# Altium schematic sheet [4] Wifi_ESP32_Antenna.SchDoc
size A4; Organization: UNMEI ELECTRICAL; Address1: 16B/12 Nguyen Du Street; Address2: Da Lat City, LD Province; SheetNumber: 4; SheetTotal: 7
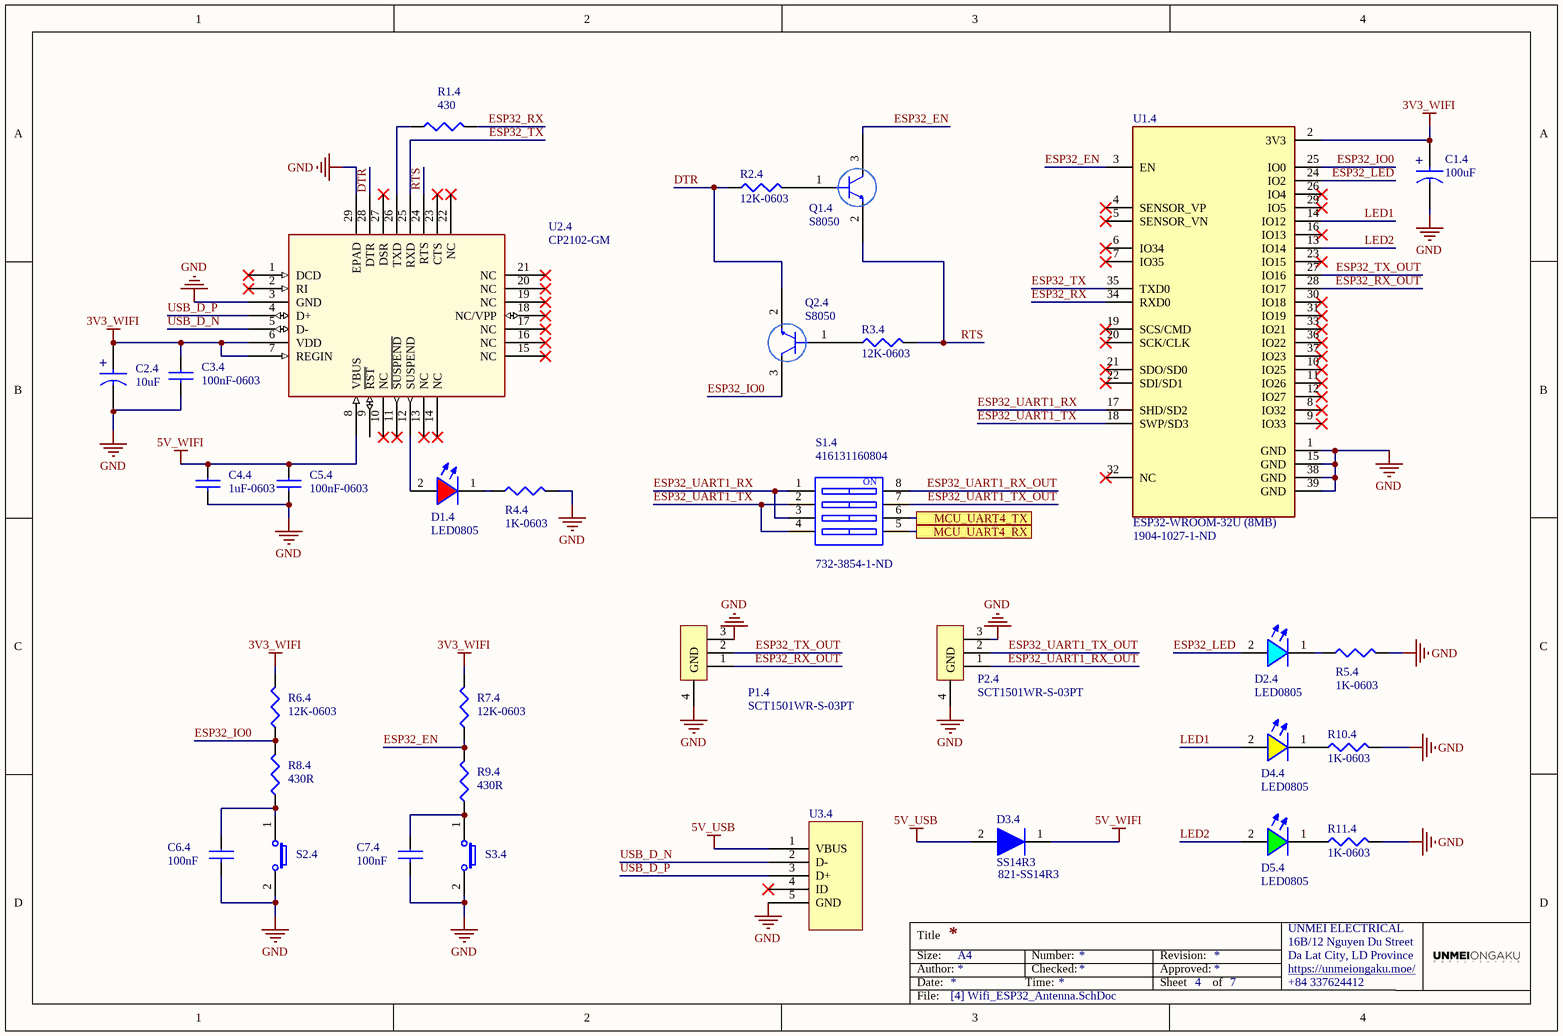
[diagram p0: [4] Wifi_ESP32_Antenna.SchDoc]

## Parts
C1.4  100uF  [Capacitor/Tantalum  - SMD6032/C - AVX]
C2.4  10uF  [Capacitor/Tantalum  - SMD3528/B - AVX]
C3.4  100nF-0603  [CAP0603]
C4.4  1uF-0603  [CAP0603]
C5.4  100nF-0603  [CAP0603]
C6.4  100nF  [CAP0603]
C7.4  100nF  [CAP0603]
D1.4  LED0805  [LED0805-RED]
D2.4  LED0805  [LED0805-BLUE]
D3.4  SS14R3  Supplier Part Number 1: 821-SS14R3  [SS14 - 1N5819 / DO-214AA, SMA]
D4.4  LED0805  [LED0805-YELLOW]
D5.4  LED0805  [LED0805-GREEN]
P1.4  SCT1501WR-S-03PT  [Connector ZH1.5 3P SMD]
P2.4  SCT1501WR-S-03PT  [Connector ZH1.5 3P SMD]
Q1.4  S8050  [SOT23]
Q2.4  S8050  [SOT23]
R1.4  430  [RES0603 - 3D]
R2.4  12K-0603  [RES0603 - 3D]
R3.4  12K-0603  [RES0603 - 3D]
R4.4  1K-0603  [RES0603 - 3D]
R5.4  1K-0603  [RES0603 - 3D]
R6.4  12K-0603  [RES0603 - 3D]
R7.4  12K-0603  [RES0603 - 3D]
R8.4  430R  [RES0603 - 3D]
R9.4  430R  [RES0603 - 3D]
R10.4  1K-0603  [RES0603 - 3D]
R11.4  1K-0603  [RES0603 - 3D]
S1.4  416131160804  Supplier Part Number 1: 732-3854-1-ND  [DIP Switches SMD 1.27mm 4P]
S2.4  434121043816  [Switches-6x3.5x4.3mm]  (value not drawn)
S3.4  434121043816  [Switches-6x3.5x4.3mm]  (value not drawn)
U1.4  ESP32-WROOM-32U (8MB)  Supplier Part Number 1: 1904-1027-1-ND  [ESP32 WROOM 32U]
U2.4  CP2102-GM  [QFN28_5X5_SIL]
U3.4  Micro USB - UJ2-MIBH-G-SMT-TR  [Micro USB V2 SMD]  (value not drawn)

## Ports
MCU_UART4_RX, MCU_UART4_TX

## Nets
3V3_WIFI: C1.4.1 C2.4.1 C3.4.1 R6.4.2 R7.4.2 U1.4.2(3V3) U2.4.6(VDD) U2.4.7(REGIN)
5V_USB: D3.4.2 U3.4.1(VBUS)
5V_WIFI: C4.4.1 C5.4.1 D3.4.1 U2.4.8(VBUS)
GND: C1.4.2 C2.4.2 C3.4.2 C4.4.2 C5.4.2 C6.4.2 C7.4.2 P1.4.3 P1.4.4(GND) P2.4.3 P2.4.4(GND) R4.4.2 R5.4.2 R10.4.2 R11.4.2 S2.4.2 S3.4.2 U1.4.1(GND) U1.4.15(GND) U1.4.38(GND) U1.4.39(GND) U2.4.3(GND) U2.4.29(EPAD) U3.4.5(GND)
DTR: Q2.4.2 R2.4.1 U2.4.28(DTR)
ESP32_EN: Q1.4.3 R7.4.1 R9.4.2 U1.4.3(EN)
ESP32_IO0: Q2.4.3 R6.4.1 R8.4.2 U1.4.25(IO0)
ESP32_LED: D2.4.2(+) U1.4.24(IO2)
ESP32_RX: R1.4.2 U1.4.34(RXD0)
ESP32_RX_OUT: P1.4.1 U1.4.28(IO17)
ESP32_TX: U1.4.35(TXD0) U2.4.25(RXD)
ESP32_TX_OUT: P1.4.2 U1.4.27(IO16)
ESP32_UART1_RX: S1.4.1 S1.4.3 U1.4.17(SHD/SD2)
ESP32_UART1_RX_OUT: P2.4.1 S1.4.8
ESP32_UART1_TX: S1.4.2 S1.4.4 U1.4.18(SWP/SD3)
ESP32_UART1_TX_OUT: P2.4.2 S1.4.7
LED1: D4.4.2(+) U1.4.14(IO12)
LED2: D5.4.2(+) U1.4.13(IO14)
MCU_UART4_RX: S1.4.5 ; port MCU_UART4_RX
MCU_UART4_TX: S1.4.6 ; port MCU_UART4_TX
RTS: Q1.4.2 R3.4.2 U2.4.24(RTS)
USB_D_N: U2.4.5(D-) U3.4.2(D-)
USB_D_P: U2.4.4(D+) U3.4.3(D+)
NetC6.4_1: C6.4.1 R8.4.1 S2.4.1
NetC7.4_1: C7.4.1 R9.4.1 S3.4.1
NetD1.4_1: D1.4.1(+) R4.4.1
NetD1.4_2: D1.4.2(+) U2.4.12(SUSPEND)
NetD2.4_1: D2.4.1(+) R5.4.1
NetD4.4_1: D4.4.1(+) R10.4.1
NetD5.4_1: D5.4.1(+) R11.4.1
NetQ1.4_1: Q1.4.1 R2.4.2
NetQ2.4_1: Q2.4.1 R3.4.1
NetR1.4_1: R1.4.1 U2.4.26(TXD)

Not connected (* = marked no-connect by the designer): U1.4 4(SENSOR_VP)* 5(SENSOR_VN)* 6(IO34)* 7(IO35)* 8(IO32)* 9(IO33)* 10(IO25)* 11(IO26)* 12(IO27)* 16(IO13)* 19(SCS/CMD)* 20(SCK/CLK)* 21(SDO/SD0)* 22(SDI/SD1)* 23(IO15)* 26(IO4)* 29(IO5)* 30(IO18)* 31(IO19)* 32(NC)* 33(IO21)* 36(IO22)* 37(IO23)*; U2.4 1(DCD)* 2(RI)* 9(~{RST}) 10(NC)* 11(~{SUSPEND})* 13(NC)* 14(NC)* 15(NC)* 16(NC)* 17(NC)* 18(NC/VPP)* 19(NC)* 20(NC)* 21(NC)* 22(NC)* 23(CTS)* 27(DSR)*; U3.4 4(ID)*

## Notes on the sheet
- Title
- Size:
- Date:
- Author:
- A4
- Time:
- Number:
- Checked:
- Revision:
- Sheet
- Approved:
- of
- https://unmeiongaku.moe/
- +84 337624412
- File:
- (in symbol 416131160804) ON
- (in symbol TAJB106K016RNJ) +
- (in symbol TAJC107K006RNJ) +

## Library data of the parts
C1.4 = TAJC107K006RNJ: 钽电容 100uF ±10% 6.3V 0.9Ω C型6032; Manufacturer: Kyocera AVX; Dielectric Material: Tantalum; ESR (Equivalent Series Resistance): 900mR; Leakage Current: 6.3uA; Polarity: Polar; Dissipation Factor: 6%; Supplier 1: RSComponents; Manufacturer Part Number: TAJC107K006RNJ; RoHS: Yes; Category: Tantalum Capacitors; Stock 1: 1; Pricing 1: 20=0.52900, 100=0.36400, 400=0.34700, 1000=0.21400 (USD); Mount: Surface Mount; Case/Package: Molded; Case Code (Metric): 6032; Case Code (Imperial): 2312; Min Operating Temperature: -55°C; Max Operating Temperature: 125°C; Capacitance: 100uF; Tolerance: 10%; Packaging: Tape and Reel; Voltage Rating: 6.3V; Package Quantity: 1; Termination: SMD/SMT; Features: General Purpose; Series: TAJ; Construction: Flat; Length: 6mm; Width: 3.2mm; Height: 2.6mm; Depth: 3.2mm; Height - Seated (Max): 0.11inch; Radiation Hardening: No; REACH SVHC: No SVHC; Lead Free: Lead Free; RoHS Compliant: Yes; ComponentLink1URL: https://datasheet.ciiva.com/26341/559444-da-01-en-tacc-c-6-0-mm-x-3-2-mm-x-2-6-mm-100-uf-26341781.pdf?src-supplier=Conrad; ComponentLink1Description: https://datasheet.ciiva.com/26341/559444-da-01-en-tacc-c-6-0-mm-x-3-2-mm-x-2-6-mm-100-uf-26341781.pdf?src-supplier=Conrad; ComponentLink2URL: https://datasheet.ciiva.com/18710/taj-eng-18710877.pdf?src-supplier=Distrelec; ComponentLink2Description: https://datasheet.ciiva.com/18710/taj-eng-18710877.pdf?src-supplier=Distrelec; ComponentLink3URL: https://datasheet.ciiva.com/7720/1680476-7720614.pdf?src-supplier=Element14; ComponentLink3Description: https://datasheet.ciiva.com/7720/1680476-7720614.pdf?src-supplier=Element14; ComponentLink4URL: https://datasheet.ciiva.com/7720/1680476-7720613.pdf?src-supplier=Element14; ComponentLink4Description: https://datasheet.ciiva.com/7720/1680476-7720613.pdf?src-supplier=Element14; ComponentLink5URL: https://datasheet.ciiva.com/264/taj-264329.pdf?src-supplier=Digi-Key; ComponentLink5Description: https://datasheet.ciiva.com/264/taj-264329.pdf?src-supplier=Digi-Key; ComponentLink6URL: https://datasheet.ciiva.com/264/taj-264328.pdf?src-supplier=Digi-Key; ComponentLink6Description: https://datasheet.ciiva.com/264/taj-264328.pdf?src-supplier=Digi-Key; ComponentLink7URL: https://datasheet.ciiva.com/264/taj-264330.pdf?src-supplier=Digi-Key; ComponentLink7Description: https://datasheet.ciiva.com/264/taj-264330.pdf?src-supplier=Digi-Key; ComponentLink8URL: https://datasheet.ciiva.com/12910/taj-27497-12910474.pdf?src-supplier=Mouser; ComponentLink8Description: https://datasheet.ciiva.com/12910/taj-27497-12910474.pdf?src-supplier=Mouser; ComponentLink9URL: https://datasheet.ciiva.com/3004/taj-3004480.pdf?src-supplier=Avnet; ComponentLink9Description: https://datasheet.ciiva.com/3004/taj-3004480.pdf?src-supplier=Avnet; ComponentLink10URL: https://datasheet.ciiva.com/3004/taj-3004481.pdf?src-supplier=Avnet; ComponentLink10Description: https://datasheet.ciiva.com/3004/taj-3004481.pdf?src-supplier=Avnet; Supplier Part Number 1: 1364517
C2.4 = TAJB106K016RNJ: 钽电容 10uF ±10% 16V 2.8Ω B型3528; Manufacturer: Kyocera AVX; Dielectric Material: Tantalum; ESR (Equivalent Series Resistance): 2.8R; Leakage Current: 1.6uA; Voltage: 10V; Dissipation Factor: 6%; Polarity: Polar; Supplier 1: Newark; Manufacturer Part Number: TAJB106K016RNJ; RoHS: Yes; Category: Tantalum Capacitors; Stock 1: 2000; Pricing 1: 1=0.15600, 2000=0.15600 (USD); Mount: Surface Mount,PCB; Case/Package: 1210; Number of Pins: 2; Case Code (Metric): 3528; Case Code (Imperial): 1210; Min Operating Temperature: -55°C; Max Operating Temperature: 125°C; Capacitance: 10uF; Tolerance: 10%; Packaging: Tape and Reel; Voltage Rating (DC): 16V; Package Quantity: 1; Voltage Rating: 16V; Termination: SMD/SMT; Features: General Purpose; Series: TAJ; Construction: Flat; Length: 3.5mm; Width: 0.11inch; Height: 1.9mm; Depth: 2.8mm; Height - Seated (Max): 0.083inch; Lead Pitch: 1.4mm; Radiation Hardening: No; REACH SVHC: No SVHC; Lead Free: Lead Free; RoHS Compliant: Yes; ComponentLink1URL: https://datasheet.ciiva.com/26341/559424-da-01-en-tacc-b-3-2-mm-x-2-5-mm-x-1-9-mm-10-uf-26341768.pdf?src-supplier=Conrad; ComponentLink1Description: https://datasheet.ciiva.com/26341/559424-da-01-en-tacc-b-3-2-mm-x-2-5-mm-x-1-9-mm-10-uf-26341768.pdf?src-supplier=Conrad; ComponentLink2URL: https://datasheet.ciiva.com/18710/taj-eng-18710629.pdf?src-supplier=Distrelec; ComponentLink2Description: https://datasheet.ciiva.com/18710/taj-eng-18710629.pdf?src-supplier=Distrelec; ComponentLink3URL: https://datasheet.ciiva.com/7730/1680476-7730725.pdf?src-supplier=Element14; ComponentLink3Description: https://datasheet.ciiva.com/7730/1680476-7730725.pdf?src-supplier=Element14; ComponentLink4URL: https://datasheet.ciiva.com/28608/taj-28608982.pdf?src-supplier=Element14; ComponentLink4Description: https://datasheet.ciiva.com/28608/taj-28608982.pdf?src-supplier=Element14; ComponentLink5URL: https://datasheet.ciiva.com/263/taj-263602.pdf?src-supplier=Digi-Key; ComponentLink5Description: https://datasheet.ciiva.com/263/taj-263602.pdf?src-supplier=Digi-Key; ComponentLink6URL: https://datasheet.ciiva.com/263/taj-263601.pdf?src-supplier=Digi-Key; ComponentLink6Description: https://datasheet.ciiva.com/263/taj-263601.pdf?src-supplier=Digi-Key; ComponentLink7URL: https://datasheet.ciiva.com/263/taj-263603.pdf?src-supplier=Digi-Key; ComponentLink7Description: https://datasheet.ciiva.com/263/taj-263603.pdf?src-supplier=Digi-Key; ComponentLink8URL: https://datasheet.ciiva.com/12911/taj-27497-12911721.pdf?src-supplier=Mouser; ComponentLink8Description: https://datasheet.ciiva.com/12911/taj-27497-12911721.pdf?src-supplier=Mouser; ComponentLink9URL: https://datasheet.ciiva.com/14587/70001050-14587351.pdf?src-supplier=Allied+Electronics; ComponentLink9Description: https://datasheet.ciiva.com/14587/70001050-14587351.pdf?src-supplier=Allied+Electronics; ComponentLink10URL: https://datasheet.ciiva.com/3004/taj-3004425.pdf?src-supplier=Avnet; ComponentLink10Description: https://datasheet.ciiva.com/3004/taj-3004425.pdf?src-supplier=Avnet; ComponentLink11URL: https://datasheet.ciiva.com/16385/taj-16385095.pdf?src-supplier=Future+Electronics; ComponentLink11Description: https://datasheet.ciiva.com/16385/taj-16385095.pdf?src-supplier=Future+Electronics; ComponentLink12URL: https://datasheet.ciiva.com/15163/getdatasheetpartid-120870-15163420.pdf?src-supplier=Verical; ComponentLink12Description: https://datasheet.ciiva.com/15163/getdatasheetpartid-120870-15163420.pdf?src-supplier=Verical; ComponentLink13URL: https://datasheet.ciiva.com/25913/taj-25913340.pdf?src-supplier=Avnet+Europe; ComponentLink13Description: https://datasheet.ciiva.com/25913/taj-25913340.pdf?src-supplier=Avnet+Europe; ComponentLink14URL: https://datasheet.ciiva.com/16538/taj-16538428.pdf?src-supplier=Avnet+Asia; ComponentLink14Description: https://datasheet.ciiva.com/16538/taj-16538428.pdf?src-supplier=Avnet+Asia; Supplier Part Number 1: 30H0311
C3.4 C5.4 = CC0603KRX7R9BB104: CAP CER 0.1UF 50V X7R 0603; Manufacturer 1: Yageo; Category 1: Capacitors; Capacitance: 0.1µF; Tolerance: ±10%; Value: 100nF; Supplier 1: Digi-Key; Supplier Part Number 1: 311-1344-1-ND; Manufacturer Part Number 1: CC0603KRX7R9BB104; RoHS 1: RoHS Compliant; Description 1: CAP CER 0.1UF 50V X7R 0603; Stock 1: 4411645; Pricing 1: 1=0.1, 10=0.031, 100=0.014, 500=0.00998, 1000=0.00783 (USD); Packaging: Cut Tape (CT); Part Status: Active; Voltage - Rated: 50V; Temperature Coefficient: X7R; Operating Temperature: -55°C ~ 125°C; Features: -; Ratings: -; Applications: General Purpose; Failure Rate: -; Mounting Type: Surface Mount, MLCC; Package / Case: 0603 (1608 Metric); Size / Dimension: 0.063" L x 0.031" W (1.60mm x 0.80mm); Height - Seated (Max): -; Thickness (Max): 0.035" (0.90mm); Lead Spacing: -; Lead Style: -; ComponentLink1URL: http://www.yageo.com/documents/recent/UPY-GPHC_X7R_6.3V-to-50V_18.pdf; ComponentLink1Description: http://www.yageo.com/documents/recent/UPY-GPHC_X7R_6.3V-to-50V_18.pdf
C4.4 = CC0603KRX7R7BB105: CAP CER 1UF 16V X7R 0603; Manufacturer 1: Yageo; Category 1: Capacitors; Capacitance: 1µF; Tolerance: ±10%; Supplier 1: Digi-Key; Supplier Part Number 1: 311-1446-1-ND; Manufacturer Part Number 1: CC0603KRX7R7BB105; RoHS 1: RoHS Compliant; Description 1: CAP CER 1UF 16V X7R 0603; Stock 1: 274580; Pricing 1: 1=0.1, 10=0.051, 100=0.0227, 500=0.0162, 1000=0.01274 (USD); Packaging: Cut Tape (CT); Part Status: Active; Voltage - Rated: 16V; Temperature Coefficient: X7R; Operating Temperature: -55°C ~ 125°C; Features: -; Ratings: -; Applications: General Purpose; Failure Rate: -; Mounting Type: Surface Mount, MLCC; Package / Case: 0603 (1608 Metric); Size / Dimension: 0.063" L x 0.031" W (1.60mm x 0.80mm); Height - Seated (Max): -; Thickness (Max): 0.035" (0.90mm); Lead Spacing: -; Lead Style: -; ComponentLink1URL: http://www.yageo.com/documents/recent/UPY-GPHC_X7R_6.3V-to-50V_18.pdf; ComponentLink1Description: http://www.yageo.com/documents/recent/UPY-GPHC_X7R_6.3V-to-50V_18.pdf; Value: 1uF
C6.4 C7.4 = CC0603KRX7R9BB104: CAP CER 0.1UF 50V X7R 0603; Manufacturer 1: Yageo; Category 1: Capacitors; Capacitance: 0.1µF; Tolerance: ±10%; Supplier 1: Digi-Key; Supplier Part Number 1: 311-1344-1-ND; Manufacturer Part Number 1: CC0603KRX7R9BB104; RoHS 1: RoHS Compliant; Description 1: CAP CER 0.1UF 50V X7R 0603; Stock 1: 4411645; Pricing 1: 1=0.1, 10=0.031, 100=0.014, 500=0.00998, 1000=0.00783 (USD); Packaging: Cut Tape (CT); Part Status: Active; Voltage - Rated: 50V; Temperature Coefficient: X7R; Operating Temperature: -55°C ~ 125°C; Features: -; Ratings: -; Applications: General Purpose; Failure Rate: -; Mounting Type: Surface Mount, MLCC; Package / Case: 0603 (1608 Metric); Size / Dimension: 0.063" L x 0.031" W (1.60mm x 0.80mm); Height - Seated (Max): -; Thickness (Max): 0.035" (0.90mm); Lead Spacing: -; Lead Style: -; ComponentLink1URL: http://www.yageo.com/documents/recent/UPY-GPHC_X7R_6.3V-to-50V_18.pdf; ComponentLink1Description: http://www.yageo.com/documents/recent/UPY-GPHC_X7R_6.3V-to-50V_18.pdf; Value: 100nF
D1.4 = LED0805-RED
D2.4 = LED0805-BLUE
D3.4 = SS14R3: 1A, 40V, Schottky Rectifier; Manufacturer: Taiwan Semiconductor; Supplier 1: Mouser; Manufacturer Part Number: SS14R3; RoHS: Yes; Category: Uncategorized; Stock 1: 5400; Pricing 1: 3600=0.07700, 9000=0.06800, 10000=0.06800, 23400=0.06400, 48600=0.05800 (USD); Case/Package: SMA; Number of Pins: 2; ComponentLink1URL: http://components.arrow.com/part/dataview/0323_01151906?src-supplier=Arrow+Europe; ComponentLink1Description: http://components.arrow.com/part/dataview/0323_01151906?src-supplier=Arrow+Europe
D4.4 = LED0805-YELLOW
D5.4 = LED0805-GREEN
Q1.4 Q2.4 = MMS8050-H-TP: Trans Gp Bjt NPN 25V 0.5A 3-PIN SOT-23 T/r; Manufacturer: MCC; Max Collector Current: 500mA; Collector Emitter Voltage (VCEO): 600mV; Max Power Dissipation: 300mW; Transition Frequency: 150MHz; Supplier 1: Mouser; Manufacturer Part Number: MMS8050-H-TP; RoHS: Yes; Category: Uncategorized; Stock 1: 417; Pricing 1: 1=0.21000, 10=0.17100, 50=0.17100, 100=0.09100, 1000=0.04100, 10000=0.02700 (USD); Mount: Surface Mount; Case/Package: TO-236-3; Number of Pins: 3; Min Operating Temperature: -55°C; Max Operating Temperature: 150°C; Packaging: Tape and Reel; Collector Emitter Breakdown Voltage: 25V; RoHS Compliant: Yes; ComponentLink1URL: http://components.arrow.com/part/dataview/56206496S302966N2022?src-supplier=Arrow+Electronics; ComponentLink1Description: http://components.arrow.com/part/dataview/56206496S302966N2022?src-supplier=Arrow+Electronics; ComponentLink2URL: http://www.mccsemi.com/up_pdf/MMS8050(SOT-23).pdf?src-supplier=Digi-Key; ComponentLink2Description: http://www.mccsemi.com/up_pdf/MMS8050(SOT-23).pdf?src-supplier=Digi-Key; Supplier Part Number 1: 833-MMS8050-H-TP
R1.4 = RC0603JR-07430RL: Res Thick Film 0603 430 Ohm 5% 0.1W(1/10W) ±100ppm/C Pad SMD T/R; Manufacturer: Yageo; Resistance: 430R; Power Rating: 100mW; Voltage Rating: 75V; Temperature Coefficient: 100ppm/°C; Voltage Rating (DC): 50V; Supplier 1: Arrow Electronics; Manufacturer Part Number: RC0603JR-07430RL; RoHS: Yes; Category: Chip SMD Resistors; Stock 1: 4860; Pricing 1: 1=0.08790, 10=0.01230, 25=0.01220, 100=0.00530, 250=0.00520, 1000=0.00260, 3000=0.00190 (USD); Case/Package: 0603; Case Code (Metric): 1608; Case Code (Imperial): 0603; Weight: 7.1E-05oz; Size Code: 0603; Min Operating Temperature: -55°C; Max Operating Temperature: 155°C; Package Quantity: 1; Tolerance: 5%; Packaging: Tape and Reel; Resistor Type: Thick Film; Number of Terminations: 2; Termination: SMD/SMT; Max Power Dissipation: 100mW; Features: Moisture Resistant; Series: RC; Construction: Rectangular; Length: 1.6mm; Width: 0.031inch; Height: 0.022inch; Depth: 0.8mm; Military Standard: Not; Lead Free: Lead Free; RoHS Compliant: Yes; ComponentLink1URL: https://datasheet.ciiva.com/2452/pyu-r-int-thick-7-2452930.pdf?src-supplier=Digi-Key; ComponentLink1Description: https://datasheet.ciiva.com/2452/pyu-r-int-thick-7-2452930.pdf?src-supplier=Digi-Key; ComponentLink2URL: https://datasheet.ciiva.com/2452/pyu-r-int-thick-7-2452931.pdf?src-supplier=Digi-Key; ComponentLink2Description: https://datasheet.ciiva.com/2452/pyu-r-int-thick-7-2452931.pdf?src-supplier=Digi-Key; ComponentLink3URL: https://datasheet.ciiva.com/2452/pyu-r-int-thick-7-2452929.pdf?src-supplier=Digi-Key; ComponentLink3Description: https://datasheet.ciiva.com/2452/pyu-r-int-thick-7-2452929.pdf?src-supplier=Digi-Key; Supplier Part Number 1: RC0603JR-07430RL
R2.4 R3.4 R6.4 R7.4 = RC0603JR-0712KL: Thick Film Resistors - SMD 12K OHM 5%; Manufacturer: Yageo; Power Rating: 100 mW (1/10 W); Resistance: 12 kOhms; Temperature Coefficient: 100 PPM / C; Voltage Rating: 75 V; Supplier 1: Mouser; Manufacturer Part Number: RC0603JR-0712KL; RoHS: RoHS Compliant; Category: Thick Film Resistors - SMD; Stock 1: 29553; Pricing 1: 1=0.100, 10=0.008, 100=0.002, 5000=0.002 (USD); Features: RC0603 series chip resistors with lead-free terminations; Height: 0.45 mm; Length: 1.6 mm; Package / Case: 0603 (1608 metric); Packaging: Cut Tape; Product: Thick Film Resistors General Purpose; Series: RC-L; Termination Style: SMD/SMT; Tolerance: 5 %; Type: General Purpose Resistor; Width: 0.8 mm; Brand: Yageo; Case Code - in: 0603; Case Code - mm: 1608; Maximum Operating Temperature: + 155 C; Minimum Operating Temperature: - 55 C; Standard Pack Qty: 5000; RoHS - Mouser: Y; Minimum Order Quantity: 1; Reeling: True; ComponentLink1URL: https://www.mouser.com/ds/2/447/RC0603-1212058.pdf; ComponentLink1Description: https://www.mouser.com/ds/2/447/RC0603-1212058.pdf; Supplier Part Number 1: 603-RC0603JR-0712KL; Value: 12K
R4.4 R5.4 R10.4 R11.4 = RC0603JR-071KL: RES SMD 1K OHM 5% 1/10W 0603; Manufacturer 1: Yageo; Category 1: Resistors; Power (Watts): 0.1W, 1/10W; Temperature Coefficient: ±100ppm/°C; Supplier 1: Digi-Key; Supplier Part Number 1: 311-1.0KGRCT-ND; Manufacturer Part Number 1: RC0603JR-071KL; RoHS 1: RoHS Compliant; Description 1: RES SMD 1K OHM 5% 1/10W 0603; Stock 1: 2853955; Pricing 1: 1=0.1, 10=0.011, 100=0.0044, 1000=0.00198, 2500=0.00172 (USD); Packaging: Cut Tape (CT); Part Status: Active; Resistance (Ohms): 1k; Tolerance: ±5%; Composition: Thick Film; Features: Moisture Resistant; Operating Temperature: -55°C ~ 155°C; Package / Case: 0603 (1608 Metric); Supplier Device Package: 0603; Size / Dimension: 0.063" L x 0.031" W (1.60mm x 0.80mm); Height - Seated (Max): 0.022" (0.55mm); Failure Rate: -; ComponentLink1URL: http://www.yageo.com/documents/recent/PYu-RC_Group_51_RoHS_L_7.pdf; ComponentLink1Description: http://www.yageo.com/documents/recent/PYu-RC_Group_51_RoHS_L_7.pdf; Value: 1K
R8.4 R9.4 = RC0603JR-07430RL: Res Thick Film 0603 430 Ohm 5% 0.1W(1/10W) ±100ppm/C Pad SMD T/R; Manufacturer: Yageo; Power Rating: 100mW; Voltage Rating: 75V; Temperature Coefficient: 100ppm/°C; Voltage Rating (DC): 50V; Supplier 1: Arrow Electronics; Manufacturer Part Number: RC0603JR-07430RL; RoHS: Yes; Category: Chip SMD Resistors; Stock 1: 4860; Pricing 1: 1=0.08790, 10=0.01230, 25=0.01220, 100=0.00530, 250=0.00520, 1000=0.00260, 3000=0.00190 (USD); Case/Package: 0603; Case Code (Metric): 1608; Case Code (Imperial): 0603; Weight: 7.1E-05oz; Size Code: 0603; Min Operating Temperature: -55°C; Max Operating Temperature: 155°C; Package Quantity: 1; Resistance: 430R; Tolerance: 5%; Packaging: Tape and Reel; Resistor Type: Thick Film; Number of Terminations: 2; Termination: SMD/SMT; Max Power Dissipation: 100mW; Features: Moisture Resistant; Series: RC; Construction: Rectangular; Length: 1.6mm; Width: 0.031inch; Height: 0.022inch; Depth: 0.8mm; Military Standard: Not; Lead Free: Lead Free; RoHS Compliant: Yes; ComponentLink1URL: https://datasheet.ciiva.com/2452/pyu-r-int-thick-7-2452930.pdf?src-supplier=Digi-Key; ComponentLink1Description: https://datasheet.ciiva.com/2452/pyu-r-int-thick-7-2452930.pdf?src-supplier=Digi-Key; ComponentLink2URL: https://datasheet.ciiva.com/2452/pyu-r-int-thick-7-2452931.pdf?src-supplier=Digi-Key; ComponentLink2Description: https://datasheet.ciiva.com/2452/pyu-r-int-thick-7-2452931.pdf?src-supplier=Digi-Key; ComponentLink3URL: https://datasheet.ciiva.com/2452/pyu-r-int-thick-7-2452929.pdf?src-supplier=Digi-Key; ComponentLink3Description: https://datasheet.ciiva.com/2452/pyu-r-int-thick-7-2452929.pdf?src-supplier=Digi-Key; Supplier Part Number 1: RC0603JR-07430RL
S1.4 = 416131160804: DIP Switch Dimensions L x W x H: 5.6 x 2 mm Series: WS-DISV L: 6.12 mm Poles: 4; Manufacturer: Wurth Electronics; Body Material: Polyphenylene,Polyphthalamide; Mechanical Life: 2000Cycles; Contact Resistance: 50mR; Contact Current Rating: 25mA; Number of Positions: 4; Voltage Rating (DC): 24V; Electrical Life: 1000Cycles; Throw Configuration: SPST; Insulation Resistance: 100MR; Actuator Type: Slide (Standard); Pitch: 0.05inch; Washable: Yes; Supplier 1: Digi-Key; Manufacturer Part Number: 416131160804; RoHS: Yes; Category: DIP Switches; Stock 1: 13030; Pricing 1: 1=5.25000, 10=5.08200, 50=4.81400, 100=4.27900, 500=4.01200 (USD); Mount: Surface Mount; Contact Material: Copper Alloy,Gold; Contact Plating: Gold; Min Operating Temperature: -40°C; Max Operating Temperature: 85°C; Package Quantity: 1; Packaging: Cut Tape; Current Rating: 25mA; Termination: Gull Wing; Number of Circuits: 4; Max Voltage Rating (DC): 24V; Series: WS-DISV; Length: 0.241inch; Width: 5.6mm; Height: 2mm; Reach SVHC Compliant: Yes; Lead Free: Lead Free; RoHS Compliant: Yes; ComponentLink1URL: https://datasheet.ciiva.com/30467/0900766b812902d9-30467107.pdf?src-supplier=RSComponents; ComponentLink1Description: https://datasheet.ciiva.com/30467/0900766b812902d9-30467107.pdf?src-supplier=RSComponents; ComponentLink2URL: https://datasheet.ciiva.com/1528/4161311608xx-1528928.pdf?src-supplier=Element14; ComponentLink2Description: https://datasheet.ciiva.com/1528/4161311608xx-1528928.pdf?src-supplier=Element14; ComponentLink3URL: https://datasheet.ciiva.com/2863/4161311608xx-2863702.pdf?src-supplier=Digi-Key; ComponentLink3Description: https://datasheet.ciiva.com/2863/4161311608xx-2863702.pdf?src-supplier=Digi-Key; ComponentLink4URL: https://datasheet.ciiva.com/2863/4161311608xx-2863701.pdf?src-supplier=Digi-Key; ComponentLink4Description: https://datasheet.ciiva.com/2863/4161311608xx-2863701.pdf?src-supplier=Digi-Key; ComponentLink5URL: https://datasheet.ciiva.com/1625/4161311608xx-1625344.pdf?src-supplier=Farnell; ComponentLink5Description: https://datasheet.ciiva.com/1625/4161311608xx-1625344.pdf?src-supplier=Farnell
S2.4 S3.4 = 434121043816: Switch Tactile Spst-no 0.05A 12V; Manufacturer: Wurth Electronics; Mechanical Life: 50000Cycles; Actuator Material: Polymer,Liquid Crystal Polymer; Contact Current Rating: 50mA; Operating Force: 160gf; Illumination Type: Non-Illuminated,Illuminated; Throw Configuration: SPST; Insulation Resistance: 100MR; Switch Travel: 0.25mm; Switch Function: Off-Mom; Actuator Length: 0.8mm; Supplier 1: RSComponents; Manufacturer Part Number: 434121043816; RoHS: Yes; Category: Tactile Switches; Stock 1: 337; Pricing 1: 1=1.69500 (USD); Mount: Surface Mount; Contact Material: Stainless Steel,Steel; Min Operating Temperature: -40°C; Max Operating Temperature: 85°C; Current Rating: 50mA; Packaging: Tape and Reel; Termination: SMD/SMT; Series: WS-TASV; Contact Type: 1 maker; Length: 8mm; Width: 3.5mm; Height: 4.3mm; REACH SVHC: No SVHC; RoHS Compliant: Yes; ComponentLink1URL: https://datasheet.ciiva.com/30466/0900766b8126b631-30466746.pdf?src-supplier=RSComponents; ComponentLink1Description: https://datasheet.ciiva.com/30466/0900766b8126b631-30466746.pdf?src-supplier=RSComponents; ComponentLink2URL: https://datasheet.ciiva.com/29123/711754-da-01-en-taster-434121043816-29123819.pdf?src-supplier=Conrad; ComponentLink2Description: https://datasheet.ciiva.com/29123/711754-da-01-en-taster-434121043816-29123819.pdf?src-supplier=Conrad; ComponentLink3URL: https://datasheet.ciiva.com/1532/434121043816-1532524.pdf?src-supplier=Element14; ComponentLink3Description: https://datasheet.ciiva.com/1532/434121043816-1532524.pdf?src-supplier=Element14; ComponentLink4URL: https://datasheet.ciiva.com/1633/434121043816-1633934.pdf?src-supplier=Farnell; ComponentLink4Description: https://datasheet.ciiva.com/1633/434121043816-1633934.pdf?src-supplier=Farnell; Supplier Part Number 1: 7856421
U1.4 = ESP32-WROOM-32U (8MB): SMD Module, ESP32-D0WD, 64MBITS Spi Flash, Uart Mode, U.fl Antenna Connector; Manufacturer: Espressif Systems; Interface: I2C,SPI,GPIO,PWM,SDIO,UART; Frequency: 2.5GHz; Data Rate: 150Mbps; Sensitivity: -98dBm; Memory Size: 536KB; Resistance: 4.48kR; Tolerance: 0.1%; Max Power Dissipation: 125mW; Temperature Coefficient: 25ppm/°C; Supplier 1: Digi-Key; Manufacturer Part Number: ESP32-WROOM-32U (8MB); RoHS: No; Category: RF Receivers, Transceivers; Mount: Surface Mount; Case/Package: SMD/SMT; Case Code (Imperial): 0805; Case Code (Metric): 2012; Min Operating Temperature: -40°C; Max Operating Temperature: 85°C; Packaging: Cut Tape; Resistor Type: Thin Film; Number of Terminations: 2; ComponentLink1URL: https://www.espressif.com/sites/default/files/documentation/esp32-wroom-32d_esp32-wroom-32u_datasheet_en.pdf?src-supplier=Digi-Key; ComponentLink1Description: https://www.espressif.com/sites/default/files/documentation/esp32-wroom-32d_esp32-wroom-32u_datasheet_en.pdf?src-supplier=Digi-Key
U2.4 = CP2102-GM: Vendor: Silicon Labs; Built_By: EMA_UL_Team; SourceLibrary: Silicon_Labs_2015-03-23; Manufacturer_Part_Number: CP2102-GM; Copyright: Copyright (C) 2018 Accelerated Designs. All rights reserved; RefDes: RefDes; Type: DEV; Local Supplier: thegioiic; Local Supplier Part Number: *; Local Supplier Link: https://www.thegioiic.com/products/cp2102
U3.4 = Micro USB - UJ2-MIBH-G-SMT-TR: Conn Micro USB 2.0 Type B RCP 5 POS 0.65mm Solder RA SMD 5 Terminal 1 Port T/R; Manufacturer: CUI Devices; Supplier 1: Arrow Electronics; Manufacturer Part Number: UJ2-MIBH-G-SMT-TR; RoHS: Yes; Category: USB Connectors; Stock 1: 6066; Pricing 1: 1=0.44640, 10=0.33470, 25=0.33130, 50=0.32680, 100=0.29350, 250=0.28070, 500=0.26500, 1000=0.21660, 2000=0.19850, 3000=0.19000, 5000=0.18820 (USD); Supplier Part Number 1: UJ2-MIBH-G-SMT-TR